# Altium schematic sheet TP_IHM_7SEG.SchDoc
size A4
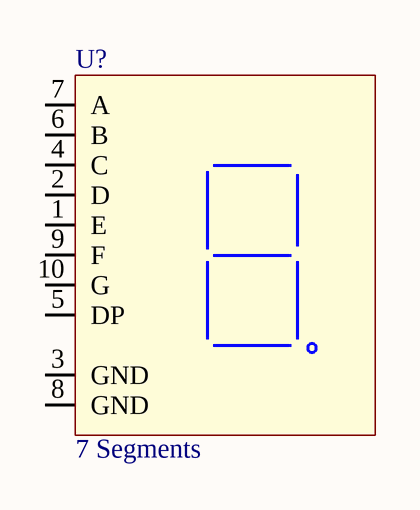
[diagram p0: TP_IHM_7SEG.SchDoc]

## Parts
U?  7 Segments  [SA10-21GWA]

## Nets

Not connected (* = marked no-connect by the designer): U? 1(E) 2(D) 3(GND) 4(C) 5(DP) 6(B) 7(A) 8(GND) 9(F) 10(G)

## Library data of the parts
U? = SC10-21SRWA: KingBright Led 7 Segments; Reference: SC10-21SRWA